# EAGLE schematic IMU connectors (EAGLE 9.5.1)
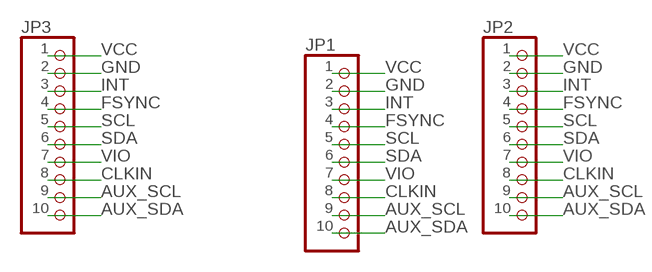
[diagram p0: schematic, sheet 1]

## Parts
JP1  PINHD-1X10  [1X10]
JP2  PINHD-1X10  [1X10]
JP3  PINHD-1X10  [1X10]

## Nets
AUX_SCL: JP1.9 JP2.9 JP3.9
AUX_SDA: JP1.10 JP2.10 JP3.10
CLKIN: JP1.8 JP2.8 JP3.8
FSYNC: JP1.4 JP2.4 JP3.4
GND: JP1.2 JP2.2 JP3.2
INT: JP1.3 JP2.3 JP3.3
SCL: JP1.5 JP2.5 JP3.5
SDA: JP1.6 JP2.6 JP3.6
VCC: JP1.1 JP2.1 JP3.1
VIO: JP1.7 JP2.7 JP3.7

## Library data of the parts
JP1-JP3 = pinhead:PINHD-1X10: PIN HEADER